# Altium schematic sheet Vertap_Overview.SchDoc: Overview
size A4; Author: Taim Al-Dabbagh; DrawnBy: Taim Al-Dabbagh; Revision: v1; SheetNumber: 1; SheetTotal: 6
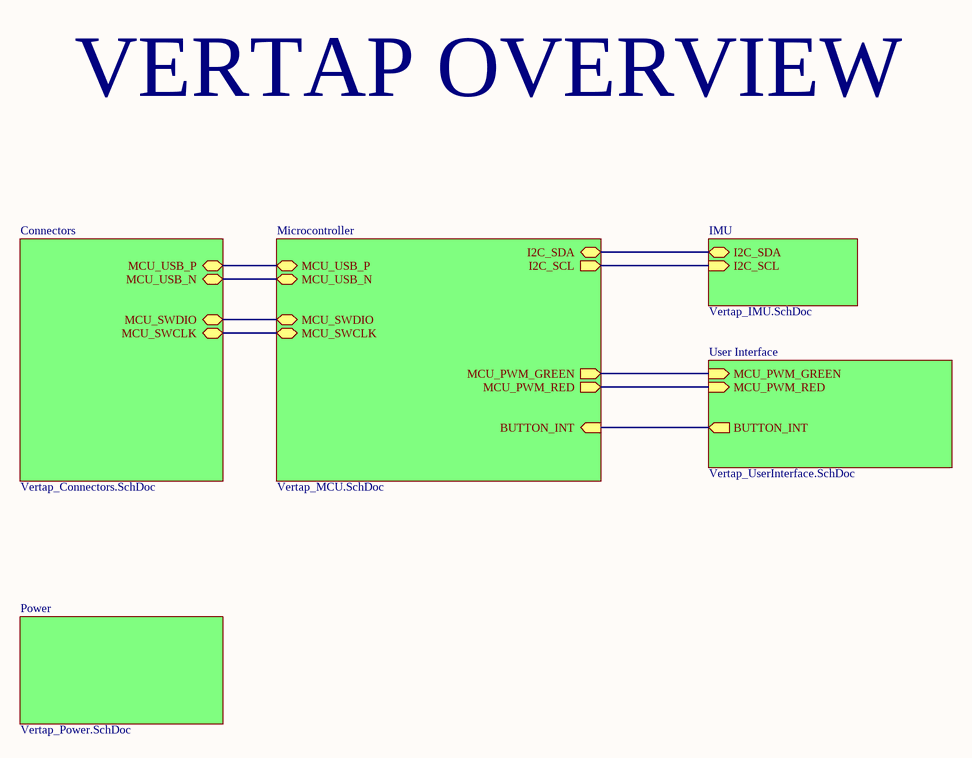
[diagram p0: Vertap_Overview.SchDoc]

## Sub-sheets
Connectors = Vertap_Connectors.SchDoc: MCU_SWCLK (bidir), MCU_SWDIO (bidir), MCU_USB_N (bidir), MCU_USB_P (bidir)
IMU = Vertap_IMU.SchDoc: I2C_SDA (bidir), I2C_SCL (in)
Microcontroller = Vertap_MCU.SchDoc: I2C_SDA (bidir), I2C_SCL (out), MCU_SWCLK (bidir), MCU_SWDIO (bidir), MCU_USB_N (bidir), MCU_USB_P (bidir), BUTTON_INT (in), MCU_PWM_GREEN (out), MCU_PWM_RED (out)
Power = Vertap_Power.SchDoc: no entries
User Interface = Vertap_UserInterface.SchDoc: BUTTON_INT (out), MCU_PWM_GREEN (in), MCU_PWM_RED (in)

## Nets
(unnamed): sheet IMU/I2C_SDA, sheet Microcontroller/I2C_SDA
(unnamed): sheet IMU/I2C_SCL, sheet Microcontroller/I2C_SCL
(unnamed): sheet Microcontroller/MCU_SWCLK, sheet Connectors/MCU_SWCLK
(unnamed): sheet Microcontroller/MCU_SWDIO, sheet Connectors/MCU_SWDIO
(unnamed): sheet Microcontroller/MCU_USB_N, sheet Connectors/MCU_USB_N
(unnamed): sheet Microcontroller/MCU_USB_P, sheet Connectors/MCU_USB_P
(unnamed): sheet Microcontroller/BUTTON_INT, sheet User Interface/BUTTON_INT
(unnamed): sheet Microcontroller/MCU_PWM_GREEN, sheet User Interface/MCU_PWM_GREEN
(unnamed): sheet Microcontroller/MCU_PWM_RED, sheet User Interface/MCU_PWM_RED

## Notes on the sheet
- VERTAP OVERVIEW